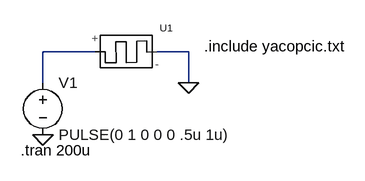
[diagram p0: schematic prog_only_mem.asc]
prog_only_mem.asc, the LTspice schematic file:
Version 4
SHEET 1 880 680
WIRE 192 64 112 64
WIRE 336 64 288 64
WIRE 112 112 112 64
WIRE 336 112 336 64
FLAG 336 112 0
FLAG 112 192 0
SYMBOL voltage 112 96 R0
WINDOW 123 0 0 Left 2
WINDOW 39 0 0 Left 2
SYMATTR InstName V1
SYMATTR Value PULSE(0 1 0 0 0 .5u 1u)
SYMBOL memristormodel 272 64 R0
SYMATTR InstName U1
SYMATTR Value MEM_YAKOPCIC
TEXT 360 56 Left 2 !.include yacopcic.txt
TEXT 78 216 Left 2 !.tran 200u

The netlist it stands for:
* prog_only_mem.asc
V1 N001 0 PULSE(0 1 0 0 0 .5u 1u)
XU1 N001 0 M MEM_YAKOPCIC  ; pins + -
.include yacopcic.txt
.tran 200u
.backanno
.end